# Altium project BoostConverter.PrjPcb
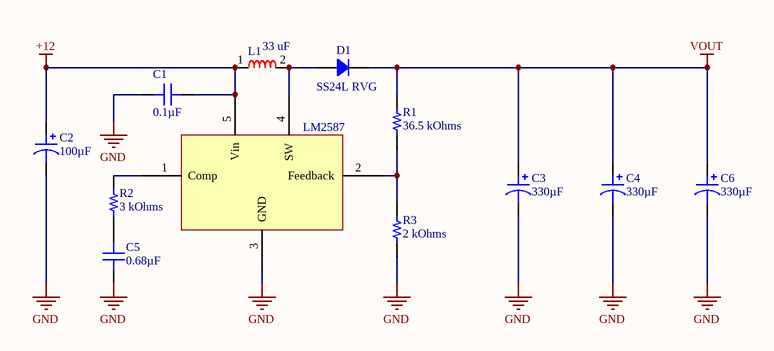
[diagram p0: BoostConverter.SchDoc]
1 sheet, 12 parts. Net scope: global (net labels, ports and power ports of the same name join across sheets).
Board file: BoostConverter.PcbDoc

## Sheet BoostConverter.SchDoc
size A4; SheetNumber: 1; SheetTotal: 1

### Parts
C1  0.1µF  [CAP 0805_2012]
C2  100µF  [CAP ALSMD 8.3MM H10.5MM]
C3  330µF  [CAP ALSMD 8.3MM H10.5MM]
C4  330µF  [CAP ALSMD 8.3MM H10.5MM]
C5  0.68µF  [CAP 0805_2012]
C6  330µF  [CAP ALSMD 8.3MM H10.5MM]
D1  SS24L RVG  [SMF DO-219AB]
L1  33 uF  [7447070]
R1  36.5 kOhms  [RES 0805_2012]
R2  3 kOhms  [RES 0805_2012]
R3  2 kOhms  [RES 0805_2012]
  LM2587  [D2PAK]

### Nets
+12: C1.1 C2.1 L1.1 .5(Vin)
GND: C1.2 C2.2 C3.2 C4.2 C5.1 C6.2 R3.1 .3(GND)
VOUT: C3.1 C4.1 C6.1 D1.2 R1.2
NetC5_2: C5.2 R2.1
NetD1_1: D1.1 L1.2 .4(SW)
NetR1_1: R1.1 R3.2 .2(Feedback)
NetR2_2: R2.2 .1(Comp)

### Library data of the parts
C1 = 0805Y0250104KXT: CAP CER 0.1UF 25V X7R 0805; Manufacturer: Knowles Syfer; Tolerance: ±10%; Part Number: 0805Y0250104KXT; Value: 0.1µF; Applications: Boardflex Sensitive; Capacitance: 0.1µF; ComponentLink1Description: Datasheet; ComponentLink1URL: https://www.knowlescapacitors.com/getattachment/2dbfc8bc-e2b3-4b4d-afb1-43b011b9ebe0/High-Std-Voltage.aspx; ComponentLink2Description: DigiKey Link; ComponentLink2URL: http://digikey.com/product-detail/en/knowles-syfer/0805Y0250104KXT/1608-1010-1-ND/5730209; Device Package: 0805 (2012 Metric); Features: Soft Termination; LastUpdated: 2.09.2020 01:04:40; Lifecycle Status: Active; Minimum Order: 1; Mounting Type: Surface Mount, MLCC; Operating Temperature: -55°C ~ 125°C; Package / Case: 0805 (2012 Metric); Packaging: TapeAndReel; PartId: 3471; Part Status: Active; Price: 0.16; Series: FlexiCap™; Size / Dimension: 0.079" L x 0.049" W (2.00mm x 1.25mm); Supplier 1: DigiKey; Supplier Part Number 1: 1608-1010-1-ND; Temperature Coefficient: X7R; Thickness (Max): 0.051" (1.30mm); Voltage - Rated: 25V
C2 = UUR1V101MNL1GS: CAP ALUM 100UF 20% 35V SMD; Manufacturer: Nichicon; Lifetime @ Temp.: 2000 Hrs @ 85°C; Ripple Current @ High Frequency: 227.5mA @ 10kHz; Ripple Current @ Low Frequency: 175mA @ 120Hz; Surface Mount Land Size: 0.327" L x 0.327" W (8.30mm x 8.30mm); Part Number: UUR1V101MNL1GS; Applications: General Purpose; Capacitance: 100µF; ComponentLink1Description: Datasheet; ComponentLink1URL: http://nichicon-us.com/english/products/pdfs/e-uur.pdf; ComponentLink2Description: DigiKey Link; ComponentLink2URL: http://digikey.com/product-detail/en/nichicon/UUR1V101MNL1GS/493-6237-1-ND/3438750; Device Package: Radial, Can - SMD; Height - Seated (Max): 0.413" (10.50mm); LastUpdated: 2.09.2020 01:25:15; Lifecycle Status: Active; Minimum Order: 1; Mounting Type: Surface Mount; Operating Temperature: -40°C ~ 85°C; Package / Case: Radial, Can - SMD; Packaging: TapeAndReel; PartId: 7563; Part Status: Active; Price: 0.18; Series: UUR; Size / Dimension: 0.315" Dia (8.00mm); Supplier 1: DigiKey; Supplier Part Number 1: 493-6237-1-ND; Tolerance: ±20%; Value: 100µF; Voltage - Rated: 35V
C3 C4 C6 = 25TLV330M8X10.5: CAP ALUM 330UF 20% 25V SMD; Manufacturer: Rubycon; Impedance: 160 mOhms; Lifetime @ Temp.: 5000 Hrs @ 105°C; Polarization: Polar; Ripple Current @ High Frequency: 600mA @ 100kHz; Ripple Current @ Low Frequency: 360mA @ 120Hz; Surface Mount Land Size: 0.327" L x 0.327" W (8.30mm x 8.30mm); Part Number: 25TLV330M8X10.5; Applications: Automotive; Capacitance: 330µF; ComponentLink1Description: Datasheet; ComponentLink1URL: http://www.rubycon.co.jp/en/catalog/e_pdfs/aluminum/e_TLV.pdf; ComponentLink2Description: DigiKey Link; ComponentLink2URL: http://digikey.com/product-detail/en/rubycon/25TLV330M8X10.5/1189-2096-1-ND/3987015; Device Package: Radial, Can - SMD; Height - Seated (Max): 0.413" (10.50mm); LastUpdated: 2.09.2020 01:25:15; Lifecycle Status: Active; Minimum Order: 1; Mounting Type: Surface Mount; Operating Temperature: -55°C ~ 105°C; Package / Case: Radial, Can - SMD; Packaging: TapeAndReel; PartId: 7519; Part Status: Active; Price: 0.27; Ratings: AEC-Q200; Series: TLV; Size / Dimension: 0.315" Dia (8.00mm); Supplier 1: DigiKey; Supplier Part Number 1: 1189-2096-1-ND; Tolerance: ±20%; Value: 330µF; Voltage - Rated: 25V
C5 = CL21B684JOFNNNE: CAP CER 0.68UF 16V X7R 0805; Manufacturer: Samsung Electro-Mechanics; Tolerance: ±5%; Part Number: CL21B684JOFNNNE; Value: 0.68µF; Applications: General Purpose; Capacitance: 0.68µF; ComponentLink1Description: Datasheet; ComponentLink1URL: http://www.samsungsem.com/kr/support/product-search/mlcc/CL21B684JOFNNNE.jsp; ComponentLink2Description: DigiKey Link; ComponentLink2URL: http://digikey.com/product-detail/en/samsung-electro-mechanics/CL21B684JOFNNNE/1276-2976-1-ND/3891062; Device Package: 0805 (2012 Metric); LastUpdated: 2.09.2020 01:04:40; Lifecycle Status: Active; Minimum Order: 1; Mounting Type: Surface Mount, MLCC; Operating Temperature: -55°C ~ 125°C; Package / Case: 0805 (2012 Metric); Packaging: TapeAndReel; PartId: 3245; Part Status: Active; Price: 0.03; Series: CL; Size / Dimension: 0.079" L x 0.049" W (2.00mm x 1.25mm); Supplier 1: DigiKey; Supplier Part Number 1: 1276-2976-1-ND; Temperature Coefficient: X7R; Thickness (Max): 0.053" (1.35mm); Voltage - Rated: 16V
D1 = SS24L RVG: DIODE SCHOTTKY 40V 2A SUB SMA; Manufacturer: Taiwan Semiconductor Corporation; Current - Reverse Leakage @ Vr: 400µA @ 40V; Speed: Fast Recovery =< 500ns, > 200mA (Io); Voltage - Forward (Vf) (Max) @ If: 500mV @ 2A; Part Number: SS24L RVG; ComponentLink1Description: Datasheet; ComponentLink1URL: https://www.taiwansemi.com/products/datasheet/SS22L%20SERIES_N15.pdf; ComponentLink2Description: DigiKey Link; ComponentLink2URL: http://digikey.com/product-detail/en/taiwan-semiconductor-corporation/SS24L-RVG/SS24LRVGCT-ND/7359547; Current - Average Rectified (Io): 2A; Diode Type: Schottky; LastUpdated: 2.09.2020 01:23:14; Lifecycle Status: Active; Minimum Order: 1; Mounting Type: Surface Mount; Operating Temperature - Junction: -55°C ~ 125°C; Package / Case: DO-219AB; Packaging: TapeAndReel; PartId: 1290; Part Status: Active; Price: 0.09; Series: -; Supplier 1: DigiKey; Supplier Part Number 1: SS24LRVGCT-ND; Supplier Device Package: Sub SMA; Voltage - DC Reverse (Vr) (Max): 40V
L1 = CustomInductor
R1 = RN73C2A36K5BTDF: RES SMD 36.5KOHM 0.1% 1/10W 0805; Manufacturer: TE Connectivity Passive Product; Power (Watts): 0.1W, 1/10W; Temperature Coefficient: ±10ppm/°C; Part Number: RN73C2A36K5BTDF; Value: 36.5 kOhms; ComponentLink1Description: Datasheet; ComponentLink1URL: https://www.te.com/commerce/DocumentDelivery/DDEController?Action=srchrtrv&DocNm=1773270&DocType=DS&DocLang=English; ComponentLink2Description: DigiKey Link; ComponentLink2URL: http://digikey.com/product-detail/en/te-connectivity-passive-product/RN73C2A36K5BTDF/A103421CT-ND/2730636; Composition: Thin Film; Device Package: 0805 (2012 Metric); Height - Seated (Max): 0.026" (0.65mm); LastUpdated: 2.09.2020 01:15:15; Lifecycle Status: Active; Minimum Order: 1; Number of Terminations: 2; Operating Temperature: -55°C ~ 155°C; Package / Case: 0805 (2012 Metric); Packaging: TapeAndReel; PartId: 32001; Part Status: Active; Price: 0.37; Resistance: 36.5 kOhms; Series: RN73, Holsworthy; Size / Dimension: 0.079" L x 0.049" W (2.00mm x 1.25mm); Supplier 1: DigiKey; Supplier Part Number 1: A103421CT-ND; Supplier Device Package: 0805; Tolerance: ±0.1%
R2 = RT0805DRD073KL: RES SMD 3K OHM 0.5% 1/8W 0805; Manufacturer: Yageo; Power (Watts): 0.125W, 1/8W; Temperature Coefficient: ±25ppm/°C; Part Number: RT0805DRD073KL; Value: 3 kOhms; ComponentLink1Description: Datasheet; ComponentLink1URL: https://www.yageo.com/upload/media/product/productsearch/datasheet/rchip/PYu-RT_1-to-0.01_RoHS_L_11.pdf; ComponentLink2Description: DigiKey Link; ComponentLink2URL: http://digikey.com/product-detail/en/yageo/RT0805DRD073KL/311-2744-1-ND/6129163; Composition: Thin Film; Device Package: 0805 (2012 Metric); Height - Seated (Max): 0.024" (0.60mm); LastUpdated: 2.09.2020 01:15:24; Lifecycle Status: Active; Minimum Order: 1; Number of Terminations: 2; Operating Temperature: -55°C ~ 155°C; Package / Case: 0805 (2012 Metric); Packaging: TapeAndReel; PartId: 27799; Part Status: Active; Price: 0.03; Resistance: 3 kOhms; Series: RT; Size / Dimension: 0.079" L x 0.049" W (2.00mm x 1.25mm); Supplier 1: DigiKey; Supplier Part Number 1: 311-2744-1-ND; Supplier Device Package: 0805; Tolerance: ±0.5%
R3 = RCS08052K00FKEA: RES SMD 2K OHM 1% 0.4W 0805; Manufacturer: Vishay Dale; Power (Watts): 0.4W, 2/5W; Temperature Coefficient: ±100ppm/°C; Part Number: RCS08052K00FKEA; Value: 2 kOhms; ComponentLink1Description: Datasheet; ComponentLink1URL: http://www.vishay.com/docs/20065/rcse3.pdf; ComponentLink2Description: DigiKey Link; ComponentLink2URL: http://digikey.com/product-detail/en/vishay-dale/RCS08052K00FKEA/541-2840-1-ND/5867133; Composition: Thick Film; Device Package: 0805 (2012 Metric); Features: Automotive AEC-Q200, Pulse Withstanding; Height - Seated (Max): 0.020" (0.50mm); LastUpdated: 2.09.2020 01:15:24; Lifecycle Status: Active; Minimum Order: 1; Number of Terminations: 2; Operating Temperature: -55°C ~ 155°C; Package / Case: 0805 (2012 Metric); Packaging: TapeAndReel; PartId: 27786; Part Status: Active; Price: 0.03; Ratings: AEC-Q200; Resistance: 2 kOhms; Series: RCS e3; Size / Dimension: 0.079" L x 0.049" W (2.00mm x 1.25mm); Supplier 1: DigiKey; Supplier Part Number 1: 541-2840-1-ND; Supplier Device Package: 0805; Tolerance: ±1%